# Altium schematic sheet schematic.SchDoc
size A4; SheetNumber: 1; SheetTotal: 1
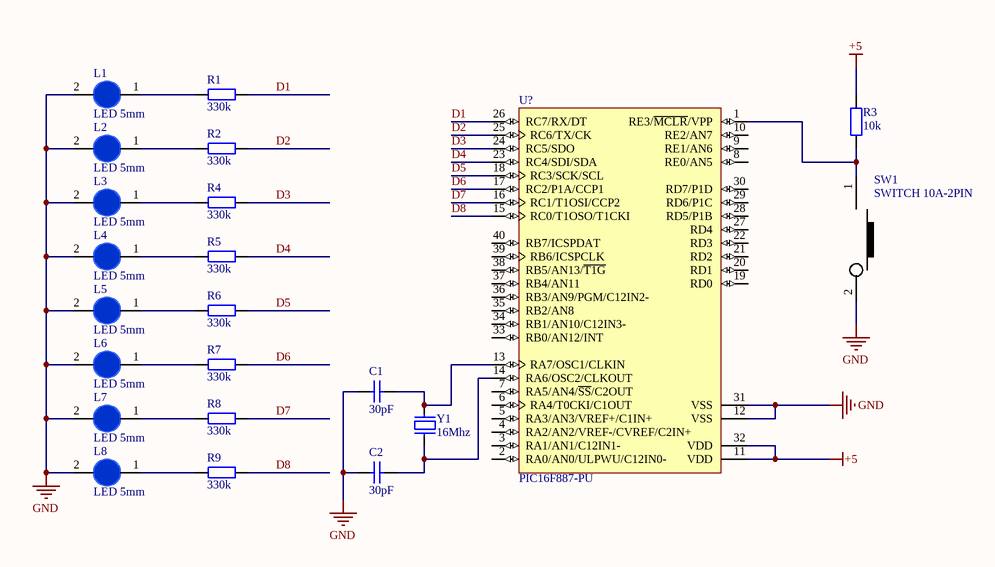
[diagram p0: schematic.SchDoc]

## Parts
C1  30pF  [tu gom]
C2  30pF  [tu gom]
L1  LED 5mm  [LED-5MM-BLUE]
L2  LED 5mm  [LED-5MM-BLUE]
L3  LED 5mm  [LED-5MM-BLUE]
L4  LED 5mm  [LED-5MM-BLUE]
L5  LED 5mm  [LED-5MM-BLUE]
L6  LED 5mm  [LED-5MM-BLUE]
L7  LED 5mm  [LED-5MM-BLUE]
L8  LED 5mm  [LED-5MM-BLUE]
R1  330k  [tro vach 1/2w]
R2  330k  [tro vach 1/2w]
R3  10k  [tro vach 1/2w]
R4  330k  [tro vach 1/2w]
R5  330k  [tro vach 1/2w]
R6  330k  [tro vach 1/2w]
R7  330k  [tro vach 1/2w]
R8  330k  [tro vach 1/2w]
R9  330k  [tro vach 1/2w]
SW1  SWITCH 10A-2PIN  [SW_2ARS_TH]
U?  PIC16F887-PU  [DIP40/W0.6]
Y1  16Mhz  [Thach Anh 2 Chan 32,768 KHz]

## Nets
+5: R3.2 U?.11(VDD) U?.32(VDD)
GND: C1.2 C2.2 L1.2(K) L2.2(K) L3.2(K) L4.2(K) L5.2(K) L6.2(K) L7.2(K) L8.2(K) SW1.2 U?.12(VSS) U?.31(VSS)
D1: R1.2 U?.26(RC7/RX/DT)
D2: R2.2 U?.25(RC6/TX/CK)
D3: R4.2 U?.24(RC5/SDO)
D4: R5.2 U?.23(RC4/SDI/SDA)
D5: R6.2 U?.18(RC3/SCK/SCL)
D6: R7.2 U?.17(RC2/P1A/CCP1)
D7: R8.2 U?.16(RC1/T1OSI/CCP2)
D8: R9.2 U?.15(RC0/T1OSO/T1CKI)
NetC1_1: C1.1 U?.13(RA7/OSC1/CLKIN) Y1.2
NetC2_1: C2.1 U?.14(RA6/OSC2/CLKOUT) Y1.1
NetL1_1: L1.1(A) R1.1
NetL2_1: L2.1(A) R2.1
NetL3_1: L3.1(A) R4.1
NetL4_1: L4.1(A) R5.1
NetL5_1: L5.1(A) R6.1
NetL6_1: L6.1(A) R7.1
NetL7_1: L7.1(A) R8.1
NetL8_1: L8.1(A) R9.1
NetR3_1: R3.1 SW1.1 U?.1(RE3/~{MCLR}/VPP)

Not connected (* = marked no-connect by the designer): U? 2(RA0/AN0/ULPWU/C12IN0-) 3(RA1/AN1/C12IN1-) 4(RA2/AN2/VREF-/CVREF/C2IN+) 5(RA3/AN3/VREF+/C1IN+) 6(RA4/T0CKI/C1OUT) 7(RA5/AN4/~{SS}/C2OUT) 8(RE0/AN5) 9(RE1/AN6) 10(RE2/AN7) 19(RD0) 20(RD1) 21(RD2) 22(RD3) 27(RD4) 28(RD5/P1B) 29(RD6/P1C) 30(RD7/P1D) 33(RB0/AN12/INT) 34(RB1/AN10/C12IN3-) 35(RB2/AN8) 36(RB3/AN9/PGM/C12IN2-) 37(RB4/AN11) 38(RB5/AN13/~{T1G}) 39(RB6/ICSPCLK) 40(RB7/ICSPDAT)

## Library data of the parts
C1 C2 = Tu gom 30pF 50V: Cắm; Don_Vi: Con; So_Chan: 2; Ten_Linh_Kien: Tụ gốm 30P; Ma_Hang: MH004772; Chung_Loai: Cắm; Kieu_Chan: *
L1-L8 = LED 5mm Xanh Duong: Cắm; Don_Vi: Con; Ma_Hang: MH008987; Ten_Linh_Kien: Led 5MM Xanh Dương Đục (1000c); Ghi_Chu: *; Kieu_Chan: *; Chung_Loai: Cắm
R1 R2 R4-R9 = Tro Vach 1/2W 5% 330k: Cắm; So_Chan: 2; Ten_Linh_Kien: Trở 5% 1/2w 330k; Ma_Hang: MH006196; Don_Vi: Con; Chung_Loai: Cắm; Kieu_Chan: *
R3 = Tro Vach 1/2W 5% 10k: Cắm; Don_Vi: Con; So_Chan: 2; Ten_Linh_Kien: Trở 5% 1/2w 10k; Ma_Hang: MH006206; Chung_Loai: Cắm; Kieu_Chan: *
SW1 = SW1_RS-471005264153-TH: Rocker Switch SPST 16A (AC), 10A (DC) 250V Panel Mount, Snap-In; Manufacturer: Würth Elektronik; Alternate Part Number-1: NA; Manufacturer Part Number: 471005264153; Case/Package: TH; Supplier-1: Würth Elektronik; Supplier Part Number-1: 471005264153
U? = PIC16F887-PU: Flash-Based, 8-Bit CMOS Microcontroller with nanoWatt Technology, 8K (x14-Bit words) Program Memory, 624 Bytes Data Memory, 35 I/O pins, 40-Pin PDIP, Standard VDD Range, Extended Temperature; Published: 29-Jan-2009; LatestRevisionDate: 02-Dec-2009; LatestRevisionNote: Updated datasheet to version revF, Apr-2009.; DatasheetVersion: revF, Apr-2009; PackageVersion: revBB, Aug-2009; PackageReference: PDIP600-P40; Publisher: Altium Limited; PackageDescription: 40-Lead Plastic Dual In-Line (P) - 600 mil Body [PDIP]; Supplier 1: Digi-Key; Supplier Part Number 1: PIC16F887-E/P-ND; Supplier 2: Farnell; Supplier Part Number 2: 1703423; ComponentLink1Description: Datasheet; ComponentLink1URL: http://ww1.microchip.com/downloads/en/DeviceDoc/41291F.pdf; ComponentLink2Description: Packaging Specification; ComponentLink2URL: http://www.microchip.com/stellent/groups/techpub_sg/documents/packagingspec/en012702.pdf; ComponentLink3Description: Microchip.com Home; ComponentLink3URL: http://www.microchip.com/
Y1 = Thach Anh 2 chan 32,768 Khz: Crystal For all Crystal 2pin.; Value: 4Mhz